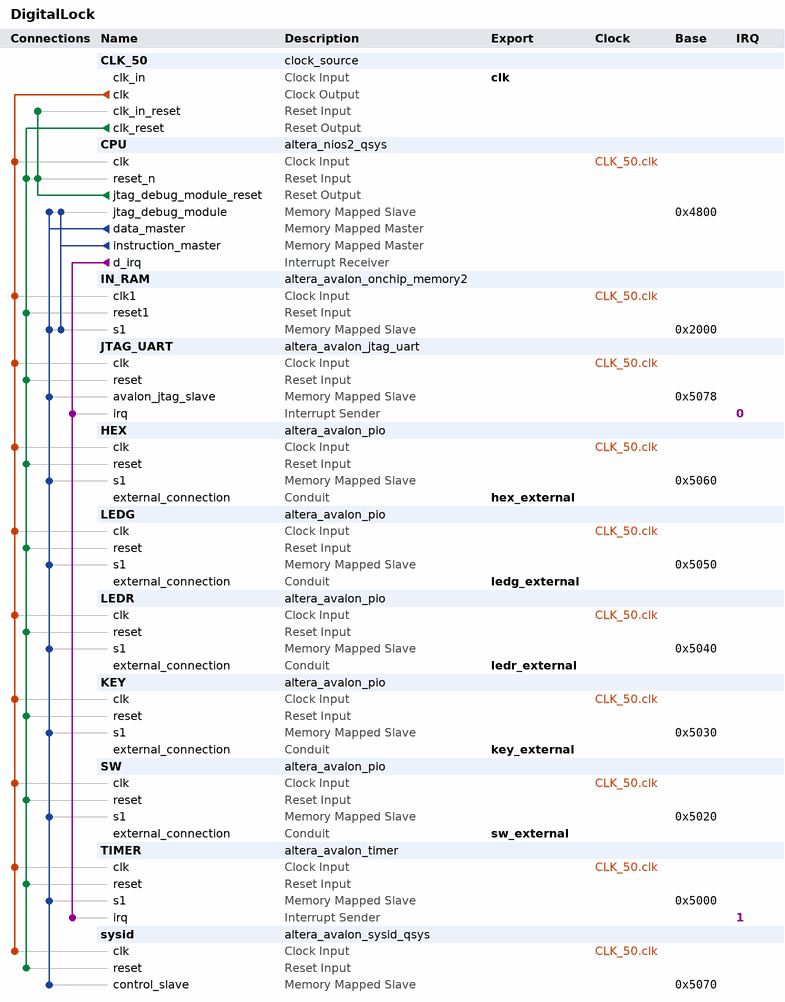
[diagram p0: system contents]
# Platform Designer (Qsys) system DigitalLock, Cyclone II EP2C20F484C7
# Parameters at their usual value, and those the tool derives, are not listed.
package require -exact qsys 13.0.1.99.2
create_system DigitalLock
set_project_property DEVICE_FAMILY {Cyclone II}
set_project_property DEVICE EP2C20F484C7

add_instance CLK_50 clock_source 13.0
set_instance_parameter_value CLK_50 clockFrequency 50000000

add_instance CPU altera_nios2_qsys 13.0
set_instance_parameter_value CPU resetSlave IN_RAM.s1
set_instance_parameter_value CPU mmu_TLBMissExcSlave None
set_instance_parameter_value CPU exceptionSlave IN_RAM.s1
set_instance_parameter_value CPU breakSlave CPU.jtag_debug_module
set_instance_parameter_value CPU impl Tiny
set_instance_parameter_value CPU icache_size 4096

add_instance IN_RAM altera_avalon_onchip_memory2 13.0.1.99.2
set_instance_parameter_value IN_RAM dataWidth 32
set_instance_parameter_value IN_RAM dualPort false
set_instance_parameter_value IN_RAM initMemContent true
set_instance_parameter_value IN_RAM initializationFileName onchip_mem.hex
set_instance_parameter_value IN_RAM memorySize 8192

add_instance JTAG_UART altera_avalon_jtag_uart 13.0.1.99.2
set_instance_parameter_value JTAG_UART simInteractiveOptions NO_INTERACTIVE_WINDOWS

add_instance HEX altera_avalon_pio 13.0.1.99.2
set_instance_parameter_value HEX direction Output
set_instance_parameter_value HEX width 28

add_instance LEDG altera_avalon_pio 13.0.1.99.2
set_instance_parameter_value LEDG direction Output
set_instance_parameter_value LEDG width 8

add_instance LEDR altera_avalon_pio 13.0.1.99.2
set_instance_parameter_value LEDR direction Output
set_instance_parameter_value LEDR width 10

add_instance KEY altera_avalon_pio 13.0.1.99.2
set_instance_parameter_value KEY direction Input
set_instance_parameter_value KEY simDoTestBenchWiring true
set_instance_parameter_value KEY width 4

add_instance SW altera_avalon_pio 13.0.1.99.2
set_instance_parameter_value SW direction Input
set_instance_parameter_value SW simDoTestBenchWiring true
set_instance_parameter_value SW width 10

add_instance TIMER altera_avalon_timer 13.0.1.99.2
set_instance_parameter_value TIMER period 1
set_instance_parameter_value TIMER periodUnits MSEC

add_instance sysid altera_avalon_sysid_qsys 13.0
set_instance_parameter_value sysid id 0

# connections
add_connection CLK_50.clk CPU.clk clock
add_connection CLK_50.clk HEX.clk clock
add_connection CLK_50.clk IN_RAM.clk1 clock
add_connection CLK_50.clk JTAG_UART.clk clock
add_connection CLK_50.clk KEY.clk clock
add_connection CLK_50.clk LEDG.clk clock
add_connection CLK_50.clk LEDR.clk clock
add_connection CLK_50.clk SW.clk clock
add_connection CLK_50.clk sysid.clk clock
add_connection CLK_50.clk TIMER.clk clock
add_connection CLK_50.clk_reset CPU.reset_n reset
add_connection CLK_50.clk_reset HEX.reset reset
add_connection CLK_50.clk_reset IN_RAM.reset1 reset
add_connection CLK_50.clk_reset JTAG_UART.reset reset
add_connection CLK_50.clk_reset KEY.reset reset
add_connection CLK_50.clk_reset LEDG.reset reset
add_connection CLK_50.clk_reset LEDR.reset reset
add_connection CLK_50.clk_reset SW.reset reset
add_connection CLK_50.clk_reset sysid.reset reset
add_connection CLK_50.clk_reset TIMER.reset reset
add_connection CPU.jtag_debug_module_reset CLK_50.clk_in_reset reset
add_connection CPU.jtag_debug_module_reset CPU.reset_n reset
add_connection CPU.data_master CPU.jtag_debug_module avalon
set_connection_parameter_value CPU.data_master/CPU.jtag_debug_module baseAddress 0x4800
add_connection CPU.data_master HEX.s1 avalon
set_connection_parameter_value CPU.data_master/HEX.s1 baseAddress 0x5060
add_connection CPU.data_master IN_RAM.s1 avalon
set_connection_parameter_value CPU.data_master/IN_RAM.s1 baseAddress 0x2000
add_connection CPU.data_master JTAG_UART.avalon_jtag_slave avalon
set_connection_parameter_value CPU.data_master/JTAG_UART.avalon_jtag_slave baseAddress 0x5078
add_connection CPU.data_master KEY.s1 avalon
set_connection_parameter_value CPU.data_master/KEY.s1 baseAddress 0x5030
add_connection CPU.data_master LEDG.s1 avalon
set_connection_parameter_value CPU.data_master/LEDG.s1 baseAddress 0x5050
add_connection CPU.data_master LEDR.s1 avalon
set_connection_parameter_value CPU.data_master/LEDR.s1 baseAddress 0x5040
add_connection CPU.data_master SW.s1 avalon
set_connection_parameter_value CPU.data_master/SW.s1 baseAddress 0x5020
add_connection CPU.data_master sysid.control_slave avalon
set_connection_parameter_value CPU.data_master/sysid.control_slave baseAddress 0x5070
add_connection CPU.data_master TIMER.s1 avalon
set_connection_parameter_value CPU.data_master/TIMER.s1 baseAddress 0x5000
add_connection CPU.instruction_master CPU.jtag_debug_module avalon
set_connection_parameter_value CPU.instruction_master/CPU.jtag_debug_module baseAddress 0x4800
add_connection CPU.instruction_master IN_RAM.s1 avalon
set_connection_parameter_value CPU.instruction_master/IN_RAM.s1 baseAddress 0x2000
add_connection CPU.d_irq JTAG_UART.irq interrupt
set_connection_parameter_value CPU.d_irq/JTAG_UART.irq irqNumber 0
add_connection CPU.d_irq TIMER.irq interrupt
set_connection_parameter_value CPU.d_irq/TIMER.irq irqNumber 1

# exported interfaces
add_interface clk clock sink
set_interface_property clk EXPORT_OF CLK_50.clk_in
add_interface hex_external conduit end
set_interface_property hex_external EXPORT_OF HEX.external_connection
add_interface ledg_external conduit end
set_interface_property ledg_external EXPORT_OF LEDG.external_connection
add_interface ledr_external conduit end
set_interface_property ledr_external EXPORT_OF LEDR.external_connection
add_interface key_external conduit end
set_interface_property key_external EXPORT_OF KEY.external_connection
add_interface sw_external conduit end
set_interface_property sw_external EXPORT_OF SW.external_connection

set_interconnect_requirement {$system} qsys_mm.clockCrossingAdapter HANDSHAKE
set_interconnect_requirement {$system} qsys_mm.maxAdditionalLatency 1

save_system DigitalLock.qsys
